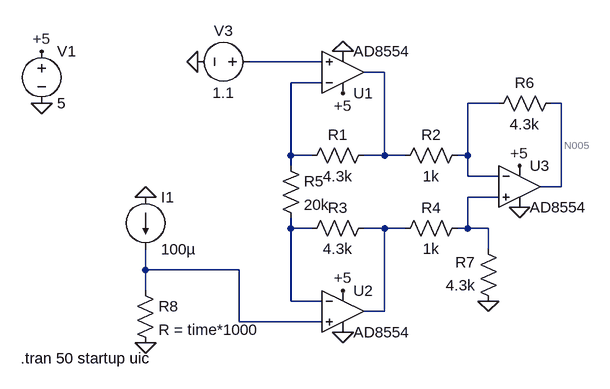
[diagram p0: schematic GeoSense_LTspice_10k.asc]
GeoSense_LTspice_10k.asc, the LTspice schematic file:
Version 4
SHEET 1 880 680
WIRE 64 16 -48 16
WIRE 160 32 128 32
WIRE 64 48 16 48
WIRE 336 80 288 80
WIRE 432 80 416 80
WIRE 16 160 16 48
WIRE 48 160 16 160
WIRE 160 160 160 32
WIRE 160 160 128 160
WIRE 192 160 160 160
WIRE 288 160 288 80
WIRE 288 160 272 160
WIRE 16 176 16 160
WIRE 288 192 288 160
WIRE 336 192 288 192
WIRE 432 208 432 80
WIRE 432 208 400 208
WIRE 336 224 288 224
WIRE 16 272 16 256
WIRE 48 272 16 272
WIRE 160 272 128 272
WIRE 192 272 160 272
WIRE 288 272 288 224
WIRE 288 272 272 272
WIRE 320 272 288 272
WIRE 320 304 320 272
WIRE -208 336 -208 304
WIRE -64 336 -208 336
WIRE -208 368 -208 336
WIRE 16 384 16 272
WIRE 64 384 16 384
WIRE 160 400 160 272
WIRE 160 400 128 400
WIRE -64 416 -64 336
WIRE 64 416 -64 416
FLAG -368 80 0
FLAG 96 0 0
FLAG 96 432 0
FLAG 368 240 0
FLAG -368 0 +5
FLAG 96 64 +5
FLAG 96 368 +5
FLAG 368 176 +5
FLAG -208 224 0
FLAG -128 16 0
FLAG -208 448 0
FLAG 320 384 0
SYMBOL OpAmps\\AD8554 96 96 M180
SYMATTR InstName U1
SYMBOL OpAmps\\AD8554 96 336 R0
SYMATTR InstName U2
SYMBOL OpAmps\\AD8554 368 144 R0
SYMATTR InstName U3
SYMBOL voltage -368 -16 R0
WINDOW 123 0 0 Left 0
WINDOW 39 0 0 Left 0
SYMATTR InstName V1
SYMATTR Value 5
SYMBOL res 144 144 R90
WINDOW 0 0 56 VBottom 2
WINDOW 3 32 56 VTop 2
SYMATTR InstName R1
SYMATTR Value 4.3k
SYMBOL res 288 144 R90
WINDOW 0 0 56 VBottom 2
WINDOW 3 32 56 VTop 2
SYMATTR InstName R2
SYMATTR Value 1k
SYMBOL res 144 256 R90
WINDOW 0 0 56 VBottom 2
WINDOW 3 32 56 VTop 2
SYMATTR InstName R3
SYMATTR Value 4.3k
SYMBOL res 288 256 R90
WINDOW 0 0 56 VBottom 2
WINDOW 3 32 56 VTop 2
SYMATTR InstName R4
SYMATTR Value 1k
SYMBOL res 0 160 R0
SYMATTR InstName R5
SYMATTR Value 20k
SYMBOL res 432 64 R90
WINDOW 0 0 56 VBottom 2
WINDOW 3 32 56 VTop 2
SYMATTR InstName R6
SYMATTR Value 4.3k
SYMBOL res 336 400 R180
WINDOW 0 36 76 Left 2
WINDOW 3 36 40 Left 2
SYMATTR InstName R7
SYMATTR Value 4.3k
SYMBOL res -224 352 R0
SYMATTR InstName R8
SYMATTR Value R = time*1000
SYMBOL voltage -32 16 R90
WINDOW 0 -32 56 VBottom 2
WINDOW 3 32 56 VTop 2
WINDOW 123 0 0 Left 0
WINDOW 39 0 0 Left 0
SYMATTR InstName V3
SYMATTR Value 1.1
SYMBOL current -208 224 R0
WINDOW 123 0 0 Left 0
WINDOW 39 0 0 Left 0
SYMATTR InstName I1
SYMATTR Value 100µ
TEXT -400 472 Left 2 !.tran 50 startup uic

The netlist it stands for:
* GeoSense_LTspice_10k.asc
XU1 N001 N003 +5 0 N002 AD8554  ; pins In+ In- V+ V- OUT
XU2 N009 N007 +5 0 N008 AD8554  ; pins In+ In- V+ V- OUT
XU3 N006 N004 +5 0 N005 AD8554  ; pins In+ In- V+ V- OUT
V1 +5 0 5
R1 N002 N003 4.3k
R2 N004 N002 1k
R3 N008 N007 4.3k
R4 N006 N008 1k
R5 N003 N007 20k
R6 N005 N004 4.3k
R7 0 N006 4.3k
R8 N009 0 R = time*1000
V3 N001 0 1.1
I1 0 N009 100µ
.tran 50 startup uic
.backanno
.end

* Results of the author's LTspice run, read from the files saved beside the schematic
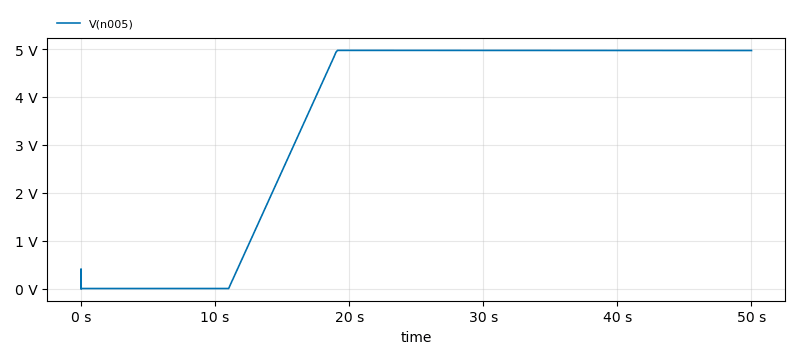
[diagram p1: Transient Analysis of GeoSense_LTspice_10k.asc, plotted from the saved traces]
* Transient Analysis, 1 run:
*   V(n005): min 0 V, max 4.972 V, average 3.476 V, rms 4.088 V, last 4.969 V